# EAGLE schematic voltagemeaurementcircuitSim (EAGLE 9.5.1)
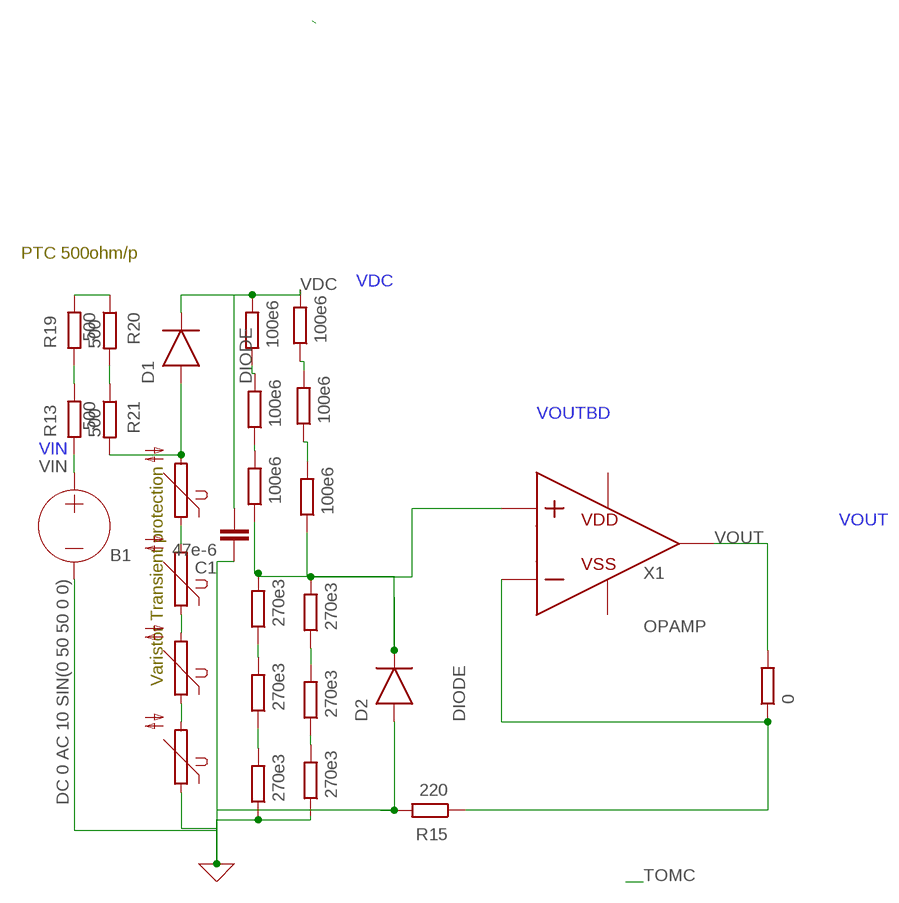
[diagram p0: schematic, sheet 1]

## Parts
B1  DC 0 AC 10 SIN(0 50 50 0 0)  NONLIN_ASRC  (no package)
C1  47e-6  C  (no package)
D1  DIODE  (no package)
D2  DIODE  (no package)
R1  100e6  R  (no package)
R2  100e6  R  (no package)
R3  100e6  R  (no package)
R4  100e6  R  (no package)
R5  100e6  R  (no package)
R6  100e6  R  (no package)
R7  270e3  R  (no package)
R8  270e3  R  (no package)
R9  270e3  R  (no package)
R10  270e3  R  (no package)
R11  270e3  R  (no package)
R12  270e3  R  (no package)
R13  500  R  (no package)
R14  500e7  S14K11  [S14K11]
R15  220  R  (no package)
R16  500e7  S14K11  [S14K11]
R17  500e7  S14K11  [S14K11]
R18  500e7  S14K11  [S14K11]
R19  500  R  (no package)
R20  500  R  (no package)
R21  500  R  (no package)
R23  0  R  (no package)
X1  OPAMP  (no package)

## Nets
0: B1.- C1.1 D2.A R11.1 R12.1 R15.2 R18.1 ; supply symbol labelled GND
N$1: D1.A R14.2 R21.2
N$3: R10.1 R12.2
N$4: R9.1 R11.2
N$5: R7.1 R9.2
N$6: R8.1 R10.2
N$8: R2.1 R3.2
N$9: R1.1 R2.2
N$10: R4.1 R5.2
N$11: R5.1 R6.2
N$12: R13.2 R19.1
N$13: R19.2 R20.1
N$14: R20.2 R21.1
N$16: R14.1 R16.2
N$17: R16.1 R17.2
N$18: R17.1 R18.2
N$21: R15.1 R23.1 X1.N
VDC: C1.2 D1.C R1.2 R4.2
VIN: B1.+ R13.1
VOUT: R23.2 X1.VOUT
VOUTBD: D2.C R3.1 R6.1 R7.2 R8.2 X1.P
Unconnected: X1.VDD X1.VSS

## Notes on the sheet
- PTC 500ohm/p
- Varistor Transient protection

## Library data of the parts
B1 = ngspice-simulation:NONLIN_ASRC: Nonlinear dependent source (ASRC) BXXXXXXX n+ n− < i = e x p r > <v= e x p r > < t c 1 = v al u e > < t c 2 = v al u e ><temp= v al u e > <dtemp= v al u e >; SPICEPREFIX: V
C1 = ngspice-simulation:C: CAPACITOR
D1 D2 = ngspice-simulation:DIODE: Diode; SPICEPREFIX: D
R1-R12 R19 = ngspice-simulation:R: RESISTOR
R13 R15 R20 R21 R23 = ngspice-simulation:R: RESISTOR; SPICEPREFIX: R
R14 R16-R18 = varistor:S14K11: VARISTOR; SPICEPREFIX: R
X1 = ngspice-simulation:OPAMP: Operational amplifier with power pins